# Altium schematic sheet [02] - Notes.SchDoc
size A4
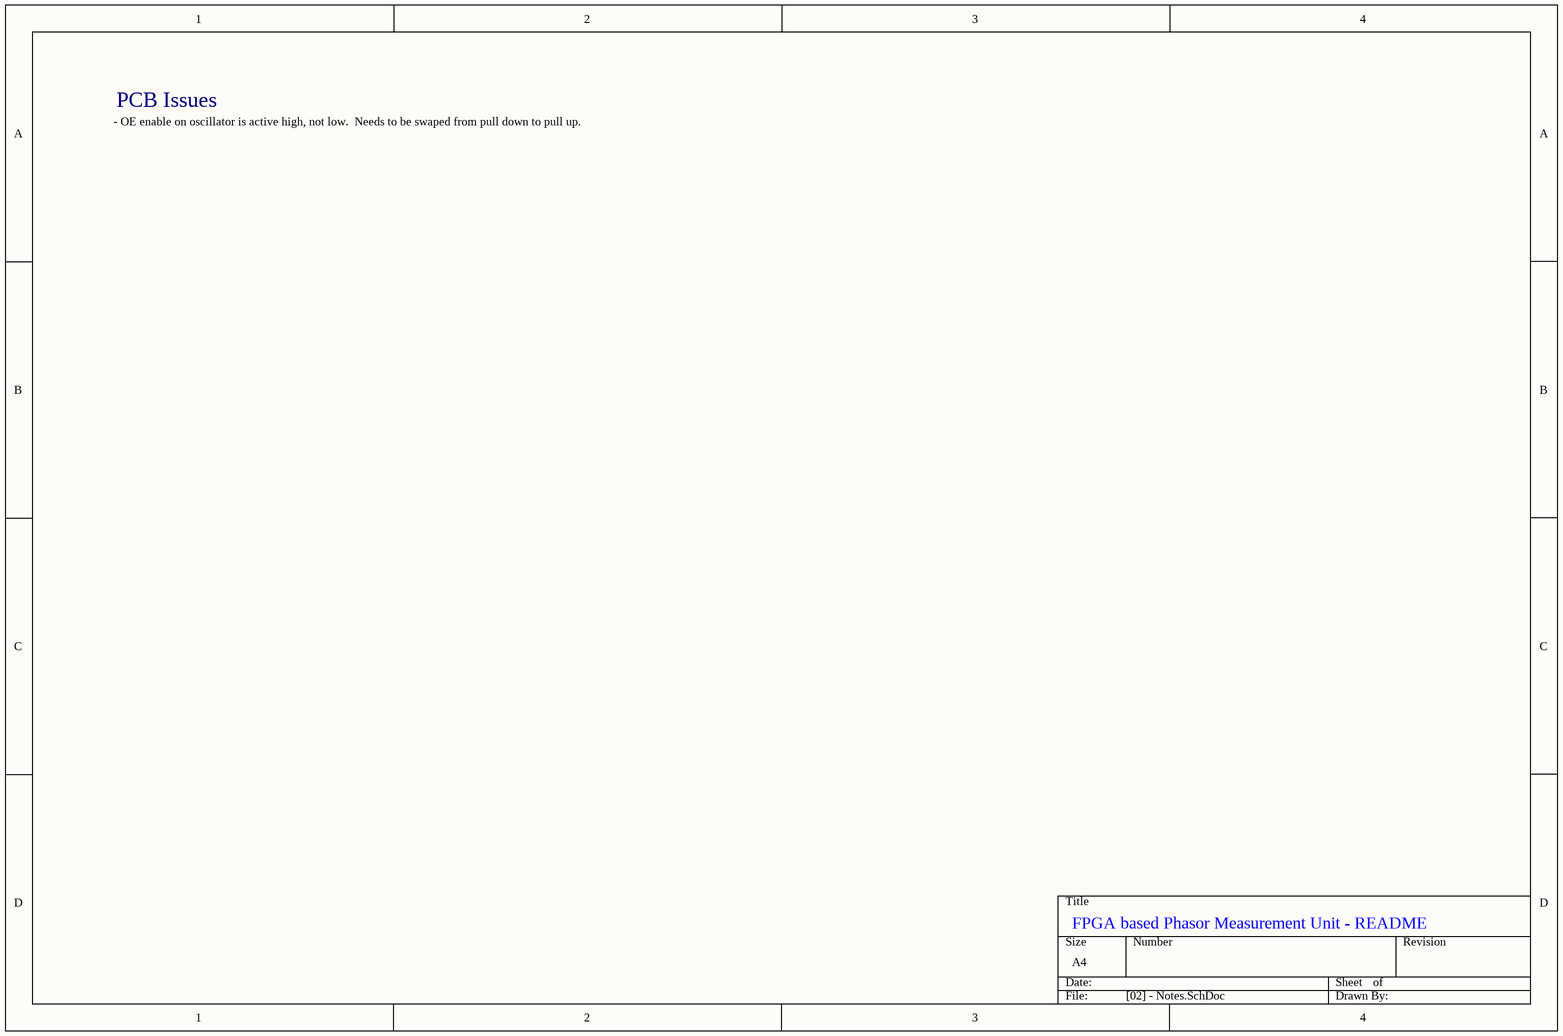
[diagram p0: [02] - Notes.SchDoc]

## Notes on the sheet
- PCB Issues
- - OE enable on oscillator is active high, not low.  Needs to be swaped from pull down to pull up.
- FPGA based Phasor Measurement Unit - README